# Altium schematic sheet Sheet1.SchDoc
size A4
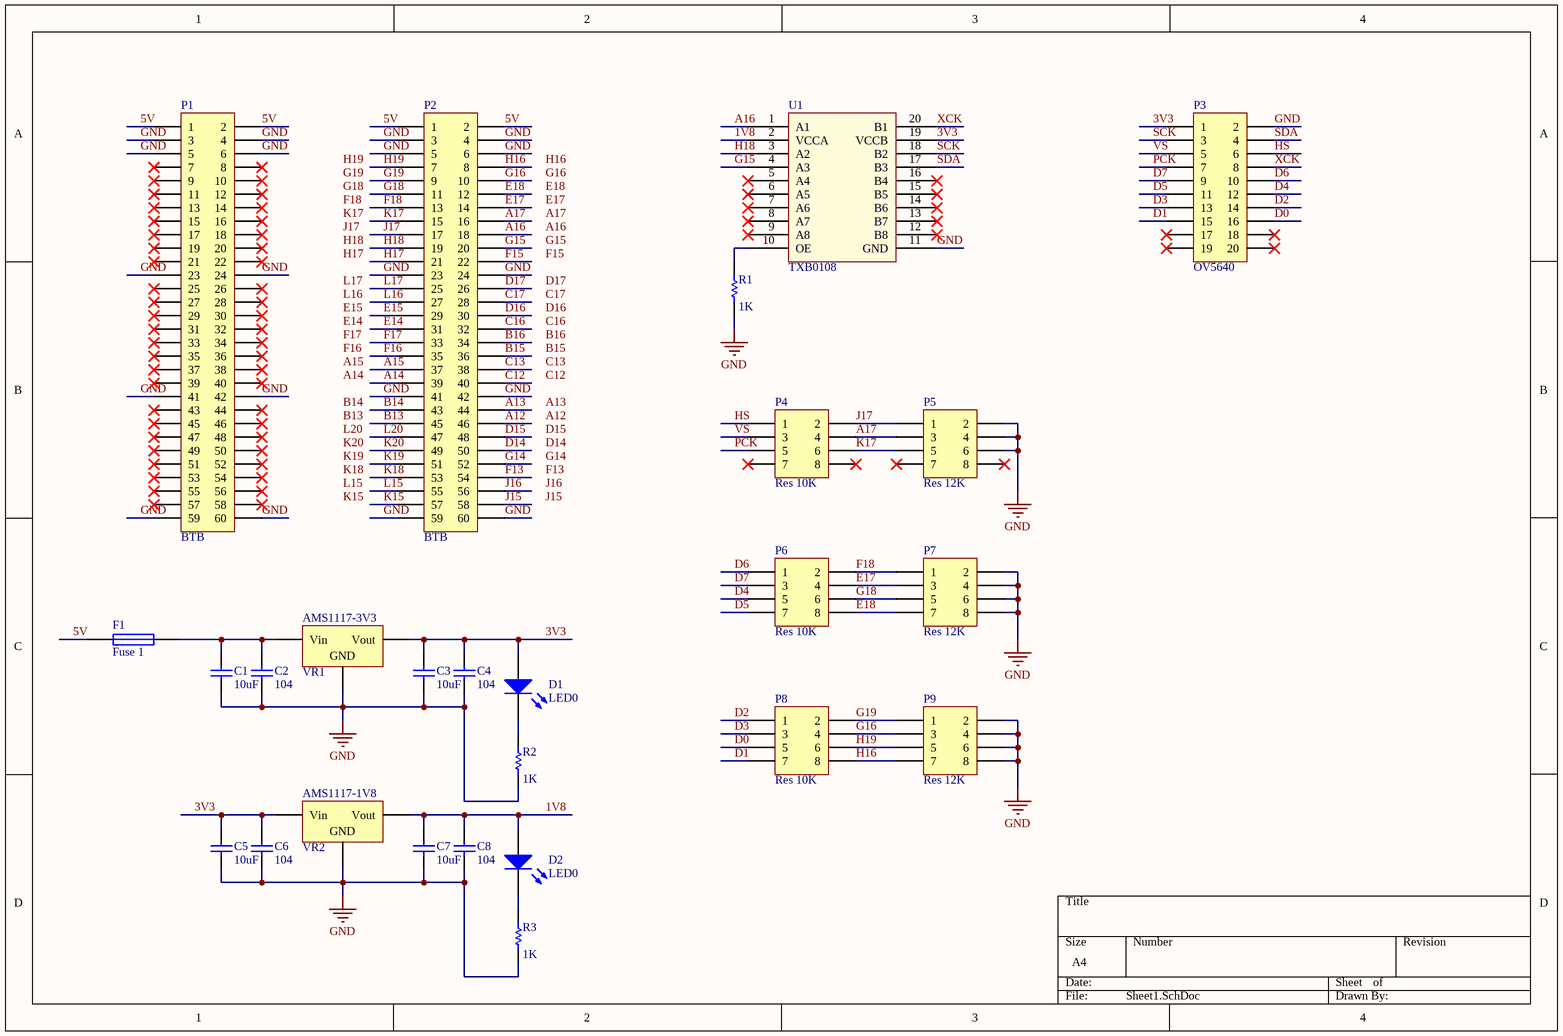
[diagram p0: Sheet1.SchDoc]

## Parts
C1  value 10uF  [R0805]  (hidden comment: Cap)
C2  value 104  [R0805]  (hidden comment: Cap)
C3  value 10uF  [R0805]  (hidden comment: Cap)
C4  value 104  [R0805]  (hidden comment: Cap)
C5  value 10uF  [R0805]  (hidden comment: Cap)
C6  value 104  [R0805]  (hidden comment: Cap)
C7  value 10uF  [R0805]  (hidden comment: Cap)
C8  value 104  [R0805]  (hidden comment: Cap)
D1  LED0  [LED0805红]
D2  LED0  [LED0805红]
F1  Fuse 1  [R0805]
P1  BTB  [BTBCON_0.8mm_60P]
P2  BTB  [BTBCON_0.8mm_60P]
P3  OV5640  [HDR2X10]
P4  Res 10K  [排阻(4位贴片)]
P5  Res 12K  [排阻(4位贴片)]
P6  Res 10K  [排阻(4位贴片)]
P7  Res 12K  [排阻(4位贴片)]
P8  Res 10K  [排阻(4位贴片)]
P9  Res 12K  [排阻(4位贴片)]
R1  value 1K  [R0805]  (hidden comment: Res Semi)
R2  value 1K  [R0805]  (hidden comment: Res1)
R3  value 1K  [R0805]  (hidden comment: Res1)
U1  TXB0108  [TXB0108]
VR1  AMS1117-3V3  [AMS1117]
VR2  AMS1117-1V8  [AMS1117]

## Nets
GND: C1.1 C2.1 C3.1 C4.1 C5.1 C6.1 C7.1 C8.1 P1.3 P1.4 P1.5 P1.6 P1.23 P1.24 P1.41 P1.42 P1.59 P1.60 P2.3 P2.4 P2.5 P2.6 P2.23 P2.24 P2.41 P2.42 P2.59 P2.60 P3.2 P5.2 P5.4 P5.6 P7.2 P7.4 P7.6 P7.8 P9.2 P9.4 P9.6 P9.8 R1.1 R2.1 R3.1 U1.11(GND) VR1.1(GND) VR2.1(GND)
1V8: C7.2 C8.2 D2.1(A) U1.2(VCCA) VR2.2(Vout)
3V3: C3.2 C4.2 C5.2 C6.2 D1.1(A) P3.1 U1.19(VCCB) VR1.2(Vout) VR2.3(Vin)
5V: F1.1 P1.1 P1.2 P2.1 P2.2
A12: P2.46
A13: P2.44
A14: P2.39
A15: P2.37
A16: P2.18 U1.1(A1)
A17: P2.16 P4.4 P5.3
B13: P2.45
B14: P2.43
B15: P2.36
B16: P2.34
C12: P2.40
C13: P2.38
C16: P2.32
C17: P2.28
D0: P3.16 P8.5
D1: P3.15 P8.7
D2: P3.14 P8.1
D3: P3.13 P8.3
D4: P3.12 P6.5
D5: P3.11 P6.7
D6: P3.10 P6.1
D7: P3.9 P6.3
D14: P2.50
D15: P2.48
D16: P2.30
D17: P2.26
E14: P2.31
E15: P2.29
E17: P2.14 P6.4 P7.3
E18: P2.12 P6.8 P7.7
F13: P2.54
F15: P2.22
F16: P2.35
F17: P2.33
F18: P2.13 P6.2 P7.1
G14: P2.52
G15: P2.20 U1.4(A3)
G16: P2.10 P8.4 P9.3
G18: P2.11 P6.6 P7.5
G19: P2.9 P8.2 P9.1
H16: P2.8 P8.8 P9.7
H17: P2.21
H18: P2.19 U1.3(A2)
H19: P2.7 P8.6 P9.5
HS: P3.6 P4.1
J15: P2.58
J16: P2.56
J17: P2.17 P4.2 P5.1
K15: P2.57
K17: P2.15 P4.6 P5.5
K18: P2.53
K19: P2.51
K20: P2.49
L15: P2.55
L16: P2.27
L17: P2.25
L20: P2.47
PCK: P3.7 P4.5
SCK: P3.3 U1.18(B2)
SDA: P3.4 U1.17(B3)
VS: P3.5 P4.3
XCK: P3.8 U1.20(B1)
NetC1_2: C1.2 C2.2 F1.2 VR1.3(Vin)
NetD1_2: D1.2(K) R2.2
NetD2_2: D2.2(K) R3.2
NetR1_2: R1.2 U1.10(OE)

Not connected (* = marked no-connect by the designer): P1 7* 8* 9* 10* 11* 12* 13* 14* 15* 16* 17* 18* 19* 20* 21* 22* 25* 26* 27* 28* 29* 30* 31* 32* 33* 34* 35* 36* 37* 38* 39* 40* 43* 44* 45* 46* 47* 48* 49* 50* 51* 52* 53* 54* 55* 56* 57* 58*; P3 17* 18* 19* 20*; P4 7* 8*; P5 7* 8*; U1 5(A4)* 6(A5)* 7(A6)* 8(A7)* 9(A8)* 12(B8)* 13(B7)* 14(B6)* 15(B5)* 16(B4)*

## Notes on the sheet
- Labels drawn without touching a wire or pin: A12, A13, A14, A15, A16, A17, B13, B14, B15, B16, C12, C13, C16, C17, D14, D15, D16, D17, E14, E15, E17, E18, F13, F15, F16, F17, F18, G14, G15, G16, G18, G19, H16, H17, H18, H19, J15, J16, J17, K15, K17, K18, K19, K20, L15, L16, L17, L20

## Library data of the parts
C1-C8 = Cap: Capacitor; Published: 8-Jun-2000; LatestRevisionDate: 17-Jul-2002; LatestRevisionNote: Re-released for DXP Platform.; PackageReference: RAD-0.3; Publisher: Altium Limited; PackageDescription: Radial Cap, Thru-Hole; 2 Leads; 0.3 in Pin Spacing
D1 D2 = LED0: Typical INFRARED GaAs LED; Published: 8-Jun-2000; LatestRevisionDate: 08-Jul-2005; LatestRevisionNote: Mech Layer 1 removed.; PackageReference: LED-0; Publisher: Altium Limited; PackageDescription: LED; 2 Leads
F1 = Fuse 1: Fuse; Published: 8-Jun-2000; LatestRevisionDate: 17-Jul-2002; LatestRevisionNote: Re-released for DXP Platform.; PackageReference: PIN-W2/E2.8; Publisher: Altium Limited; PackageDescription: Thru-Hole; 2 Leads
P1 P2 = Header 30X2: Header, 30-Pin, Dual row; LatestRevisionDate: 17-Jul-2002; LatestRevisionNote: Re-released for DXP Platform.; Publisher: Altium Limited
P3 = Header 10X2: Header, 10-Pin, Dual row; LatestRevisionDate: 17-Jul-2002; LatestRevisionNote: Re-released for DXP Platform.; Publisher: Altium Limited
P4-P9 = Header 4X2: Header, 4-Pin, Dual row; LatestRevisionDate: 17-Jul-2002; LatestRevisionNote: Re-released for DXP Platform.; Publisher: Altium Limited
R1 = Res Semi: Semiconductor Resistor; Published: 8-Jun-2000; LatestRevisionDate: 17-Jul-2002; LatestRevisionNote: Re-released for DXP Platform.; PackageReference: AXIAL-0.5; Publisher: Altium Limited; PackageDescription: Axial Device, Thru-Hole; 2 Leads; 0.5 in Pin Spacing
R2 R3 = Res1: Resistor; Published: 8-Jun-2000; LatestRevisionDate: 17-Jul-2002; LatestRevisionNote: Re-released for DXP Platform.; PackageReference: AXIAL-0.3; Publisher: Altium Limited; PackageDescription: Axial Device, Thru-Hole; 2 Leads; 0.3 in Pin Spacing
VR1 VR2 = Volt Reg: Voltage Regulator; Published: 24-Mar-1999; LatestRevisionDate: 29-May-2009; LatestRevisionNote: IPC-7351 Footprint Added.; PackageReference: D2PAK; Publisher: Altium Limited; PackageDescription: 3-Pin Transistor Outline Package 2.54 mm Pitch, 15.1 mm Lead Span